# Altium schematic sheet Breath.SchDoc
size A4
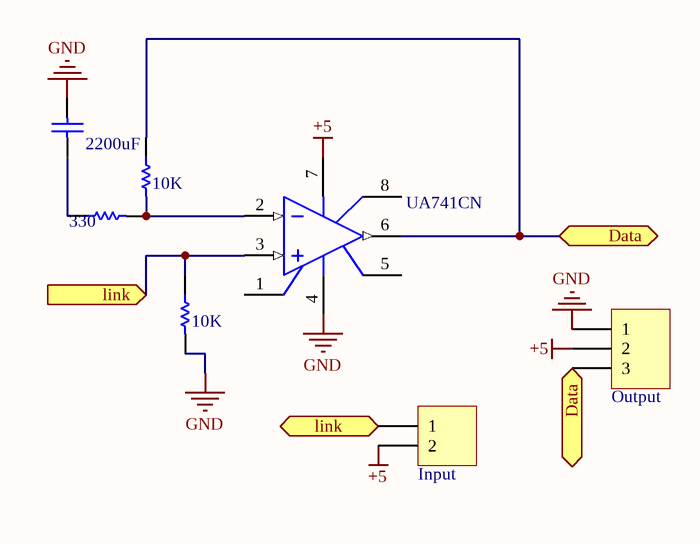
[diagram p0: Breath.SchDoc]

## Parts
10K-2  10K  [AXIAL-0.3]
10K_Juga  10K  [AXIAL-0.3]
330-2  330  [AXIAL-0.3]
2200uF  2200uF  [RAD-0.3]
o  Output  [My_1X03]
PPP  Input  [HDR1X2]
UA741CN  UA741CN  [DIP8]

## Ports
Data, link (in), link (out)

## Nets
+5: o.2 PPP.2 UA741CN.7(V+)
GND: 10K-2.2 2200uF.2 o.1 UA741CN.4(V-)
Data: 10K_Juga.1 o.3 UA741CN.6(OUT) ; port Data
link: 10K-2.1 PPP.1 UA741CN.3(IN+) ; port link
Net10K_Juga_2: 10K_Juga.2 330-2.2 UA741CN.2(IN-)
Net330-2_1: 330-2.1 2200uF.1

Not connected (* = marked no-connect by the designer): UA741CN 1(OS_NULL) 5(OS_NULL) 8(NC)

## Library data of the parts
10K-2 10K_Juga 330-2 = Res1: Resistor; Published: 8-Jun-2000; LatestRevisionDate: 17-Jul-2002; LatestRevisionNote: Re-released for DXP Platform.; PackageReference: AXIAL-0.3; Publisher: Altium Limited; PackageDescription: Axial Device, Thru-Hole; 2 Leads; 0.3 in Pin Spacing
  10K-2 10K_Juga: Value: 10K
  330-2: Value: 330
2200uF = Cap: Capacitor; Published: 8-Jun-2000; LatestRevisionDate: 17-Jul-2002; LatestRevisionNote: Re-released for DXP Platform.; PackageReference: RAD-0.3; Publisher: Altium Limited; PackageDescription: Radial Cap, Thru-Hole; 2 Leads; 0.3 in Pin Spacing; Value: 2200uF
o = Header 3: Header, 3-Pin; LatestRevisionDate: 17-Jul-2002; LatestRevisionNote: Re-released for DXP Platform.; Publisher: Altium Limited
PPP = Header 2: Header, 2-Pin; LatestRevisionDate: 17-Jul-2002; LatestRevisionNote: Re-released for DXP Platform.; Publisher: Altium Limited
UA741CN = UA741CN: General-Purpose Single Operational Amplifier; Published: 24-Aug-2001; LatestRevisionDate: 06-Jun-2005; LatestRevisionNote: Stylized 3D Model Added.; DatasheetVersion: Oct-1997; PackageReference: DIP8; Publisher: Altium Limited; PackageDescription: DIP; 8 Leads; Row Spacing 7.62 mm; Pitch 2.54 mm; Code_JEDEC: MO-001-AN; ComponentLink1Description: Manufacturer Link; ComponentLink1URL: http://www.st.com/; ComponentLink2Description: Datasheet; ComponentLink2URL: http://www.st.com/stonline/products/literature/ds/5304/ua741.pdf